# EAGLE design LoRa_E32_STM32F4 (EAGLE 9.6.2)
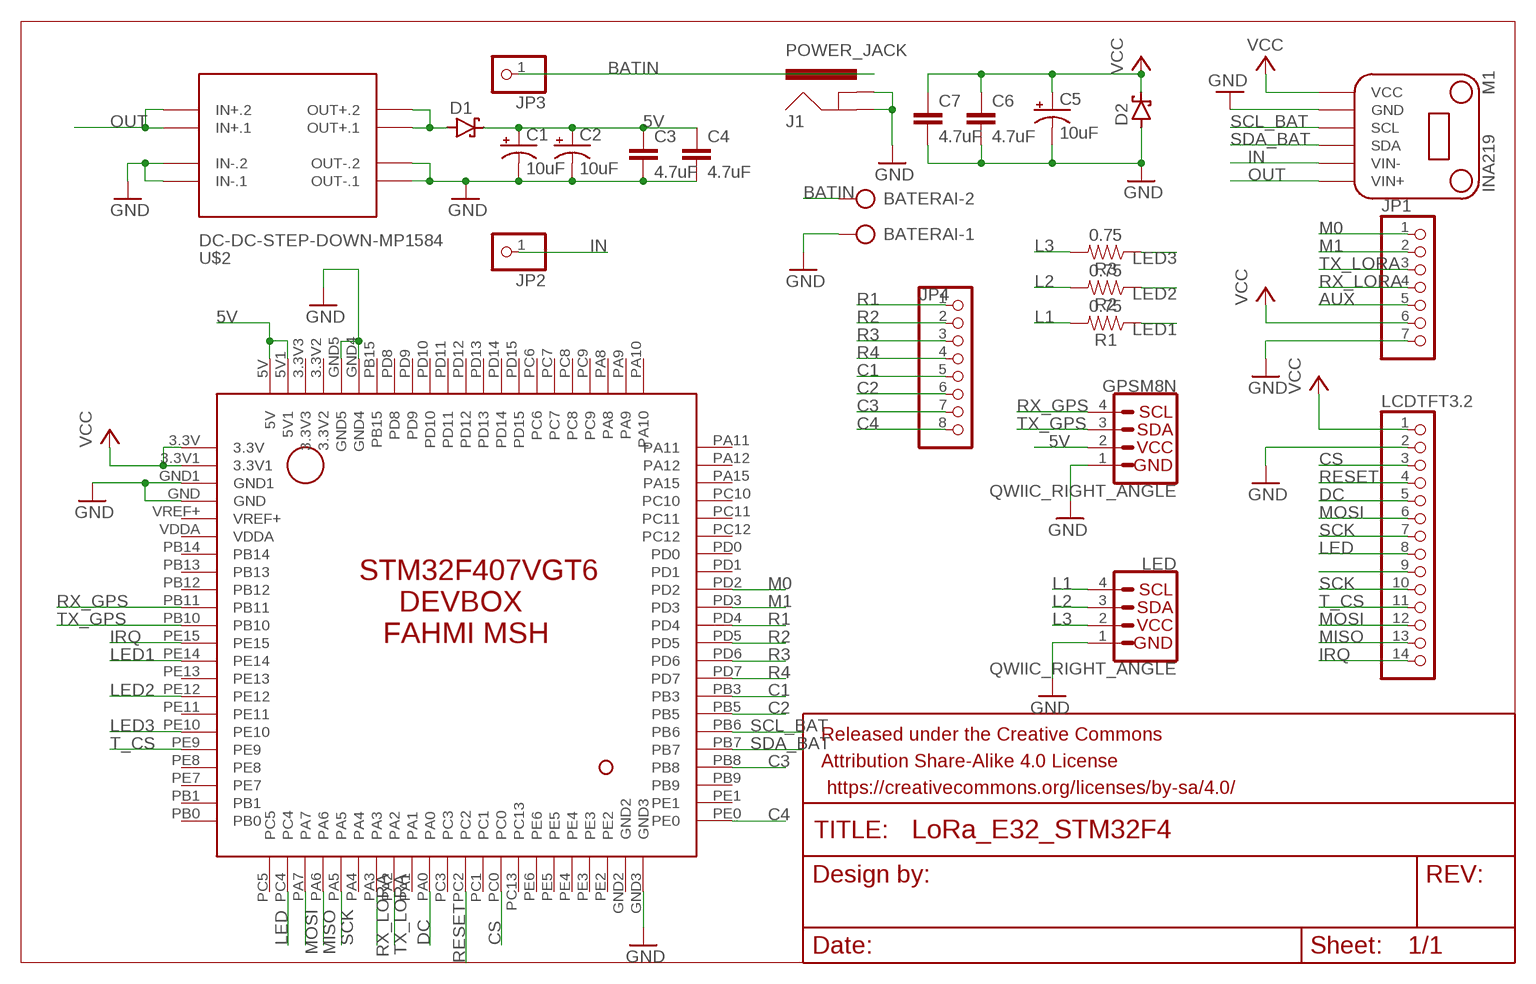
[diagram p0: schematic, sheet 1]

## Parts
BATERAI  AK500/2  [AK500/2]
C1  10uF  10UF-POLAR-EIA3216-16V-10%(TANT)  [EIA3216]
C2  10uF  10UF-POLAR-EIA3216-16V-10%(TANT)  [EIA3216]
C3  4.7uF  4.7UF-0805-50V-(10%)  [0805]
C4  4.7uF  4.7UF-0805-50V-(10%)  [0805]
C5  10uF  10UF-POLAR-EIA3216-16V-10%(TANT)  [EIA3216]
C6  4.7uF  4.7UF-0805-50V-(10%)  [0805]
C7  4.7uF  4.7UF-0805-50V-(10%)  [0805]
D1  SCHOTTKY-DIODESMD  [SMB]
D2  SCHOTTKY-DIODESMD  [SMB]
FRAME1  FRAME-LEDGER  [CREATIVE_COMMONS]
GPSM8N  QWIIC_RIGHT_ANGLE  QWIIC_CONNECTORJS-1MM  [JST04_1MM_RA]
J1  POWER_JACK  [POWER_JACK_PTH]
JP1  PINHD-1X7  [1X07]
JP2  PINHD-1X1  [1X01]
JP3  PINHD-1X1  [1X01]
JP4  PINHD-1X8/90  [1X08/90]
LCDTFT3.2  PINHD-1X14  [1X14]
LED  QWIIC_RIGHT_ANGLE  QWIIC_CONNECTORJS-1MM  [JST04_1MM_RA]
M1  INA219  [INA219]
R1  0.75  0.75OHM-0805-1/4W-1%  [0805]
R2  0.75  0.75OHM-0805-1/4W-1%  [0805]
R3  0.75  0.75OHM-0805-1/4W-1%  [0805]
U$1  STM32F4DEVBOX  [STM32F4DEVBOX]
U$2  DC-DC-STEP-DOWN-MP1584  [DC-DC-STEP-DOWN-MP1584]

## Nets
5V: C1.+ C2.+ C3.1 C4.1 D1.C GPSM8N.2 U$1.5V U$1.5V1
AUX: JP1.5
BATIN: BATERAI.2 J1.PWR JP3.1
C1: JP4.5 U$1.PB3
C2: JP4.6 U$1.PB5
C3: JP4.7 U$1.PB8
C4: JP4.8 U$1.PE0
CS: LCDTFT3.2.3 U$1.PC0
DC: LCDTFT3.2.5 U$1.PA0
GND: BATERAI.1 C1.- C2.- C3.2 C4.2 C5.- C6.2 C7.2 D2.A GPSM8N.1 J1.GND J1.GNDBREAK JP1.7 LCDTFT3.2.2 LED.1 M1.GND U$1.GND U$1.GND1 U$1.GND3 U$1.GND4 U$1.GND5 U$2.IN-.1 U$2.IN-.2 U$2.OUT-.1 U$2.OUT-.2
IN: JP2.1 M1.VIN-
IRQ: LCDTFT3.2.14 U$1.PE15
L1: LED.4 R1.2
L2: LED.3 R2.2
L3: LED.2 R3.2
LED: LCDTFT3.2.8 U$1.PC4
LED1: R1.1 U$1.PE14
LED2: R2.1 U$1.PE12
LED3: R3.1 U$1.PE10
M0: JP1.1 U$1.PD2
M1: JP1.2 U$1.PD3
MISO: LCDTFT3.2.13 U$1.PA6
MOSI: LCDTFT3.2.6 LCDTFT3.2.12 U$1.PA7
N$2: D1.A U$2.OUT+.1 U$2.OUT+.2
N$13: LCDTFT3.2.9
OUT: M1.VIN+ U$2.IN+.1 U$2.IN+.2
R1: JP4.1 U$1.PD4
R2: JP4.2 U$1.PD5
R3: JP4.3 U$1.PD6
R4: JP4.4 U$1.PD7
RESET: LCDTFT3.2.4 U$1.PC2
RX_GPS: GPSM8N.4 U$1.PB11
RX_LORA: JP1.4 U$1.PA3
SCK: LCDTFT3.2.7 LCDTFT3.2.10 U$1.PA5
SCL_BAT: M1.SCL U$1.PB6
SDA_BAT: M1.SDA U$1.PB7
T_CS: LCDTFT3.2.11 U$1.PE9
TX_GPS: GPSM8N.3 U$1.PB10
TX_LORA: JP1.3 U$1.PA2
VCC: C5.+ C6.1 C7.1 D2.C JP1.6 LCDTFT3.2.1 M1.VCC U$1.3.3V U$1.3.3V1
Unconnected: U$1.3.3V2 U$1.3.3V3 U$1.GND2 U$1.PA1 U$1.PA4 U$1.PA8 U$1.PA9 U$1.PA10 U$1.PA11 U$1.PA12 U$1.PA15 U$1.PB0 U$1.PB1 U$1.PB9 U$1.PB12 U$1.PB13 U$1.PB14 U$1.PB15 U$1.PC1 U$1.PC3 U$1.PC5 U$1.PC6 U$1.PC7 U$1.PC8 U$1.PC9 U$1.PC10 U$1.PC11 U$1.PC12 U$1.PC13 U$1.PD0 U$1.PD1 U$1.PD8 U$1.PD9 U$1.PD10 U$1.PD11 U$1.PD12 U$1.PD13 U$1.PD14 U$1.PD15 U$1.PE1 U$1.PE2 U$1.PE3 U$1.PE4 U$1.PE5 U$1.PE6 U$1.PE7 U$1.PE8 U$1.PE11 U$1.PE13 U$1.VDDA U$1.VREF+

## Library data of the parts
BATERAI = con-ptr500:AK500/2: CONNECTOR; OC_FARNELL: unknown; OC_NEWARK: unknown
C1 C2 C5 = SparkFun-Capacitors:10UF-POLAR: 10.0µF polarized capacitors A capacitor is a passive two-terminal electrical component used to store electrical energy temporarily in an electric field.; PROD_ID: CAP-00811
C3 C4 C6 C7 = SparkFun-Capacitors:4.7UF: 4.7µF ceramic capacitors A capacitor is a passive two-terminal electrical component used to store electrical energy temporarily in an electric field.; PROD_ID: CAP-15457
D1 D2 = diode:SCHOTTKY-DIODE: Schottky Diode
FRAME1 = SparkFun-Aesthetics:FRAME-LEDGER: Schematic Frame - Ledger Standard 11x14 US Ledger frame
GPSM8N LED = SparkFun-Connectors:QWIIC_CONNECTOR: SparkFun I2C Standard Qwiic Connector An SMD 1mm pitch JST connector makes it easy and quick (get it? Qwiic?) to connect I2C devices to each other. The Qwiic system <http://www.sparkfun.com/qwiic> enables fast and solderless connection between popular platforms and various sensors and actuators. We carry 200mm <https://www.sparkfun.com/products/14204>, 100mm <https://www.sparkfun.com/products/14205>, 50mm <https://www.sparkfun.com/products/14206>, and breadboard friendly <https://www.sparkfun.com/products/14207> Qwiic cables. We also offer 10 pcs strips <https://www.sparkfun.com/products/14323> the SMD connectors.; PROD_ID: CONN-13694
J1 = SparkFun-Connectors:POWER_JACK: Power Jack Connector This is the standard 5.5mm barrel jack for power. The PTH is the most common, proven, reliable, footprint. The Slot footprint only works if the mill layer is transmitted to the PCB fab house so be warned. Here are the connectors we sell at SparkFun: DC Barrel Power Jack/Connector <https://www.sparkfun.com/products/119> (PRT-00119) DC Barrel Power Jack/Connector (SMD) <https://www.sparkfun.com/products/12748> (PRT-12748) DC Barrel Jack Adapter - Breadboard Compatible <https://www.sparkfun.com/products/10811> (PRT-10811) It is used on this SparkFun product (and many, many others): SparkFun RedBoard - Programmed with Arduino <https://www.sparkfun.com/products/12757> (DEV-12757) Also, if you need a mating power supply or connector, please check these out: Wall Adapter Power Supply - 9VDC 650mA <https://www.sparkfun.com/products/298> (TOL-00298) DC Barrel Jack Adapter - Male <https://www.sparkfun.com/products/10287> (PRT-10287); PROD_ID: CONN-08197
JP1 = pinheadkecil:PINHD-1X7: PIN HEADER
JP2 JP3 = pinhead:PINHD-1X1: PIN HEADER
JP4 = pinhead:PINHD-1X8: PIN HEADER
LCDTFT3.2 = pinheadkecil:PINHD-1X14: PIN HEADER
M1 = INA219Module:INA219
R1-R3 = SparkFun-Resistors:0.75OHM: 0.75Ω resistor A resistor is a passive two-terminal electrical component that implements electrical resistance as a circuit element. Resistors act to reduce current flow, and, at the same time, act to lower voltage levels within circuits. - Wikipedia; PROD_ID: RES-08474
U$1 = STM32F4DEVBOX:STM32F4DEVBOX
U$2 = diy-modules:DC-DC-STEP-DOWN-MP1584: DC/DC Step-Down Regulator based on MP1584 chip MP1584 datasheet available here: http://www.haoyuelectronics.com/Attachment/MP1584/MP1584.pdf Click here to find device on ebay.com <http://www.ebay.com/sch/mp1584+module>

## Board
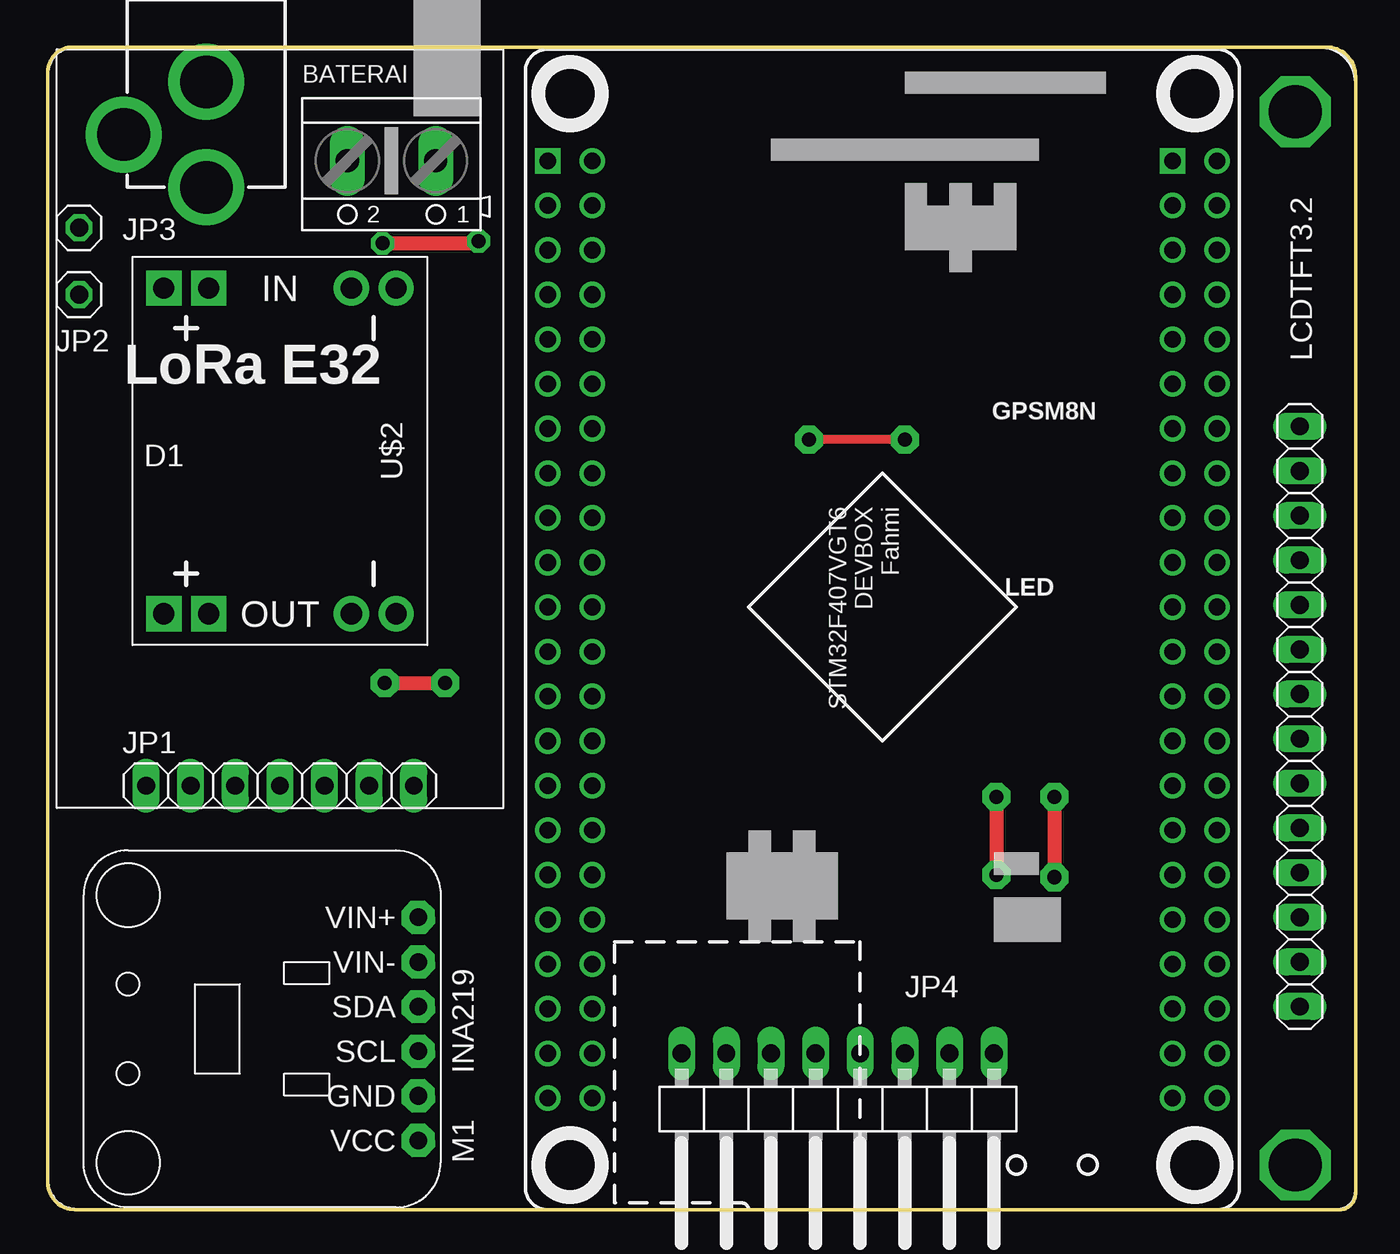
[diagram p1: board, top side]
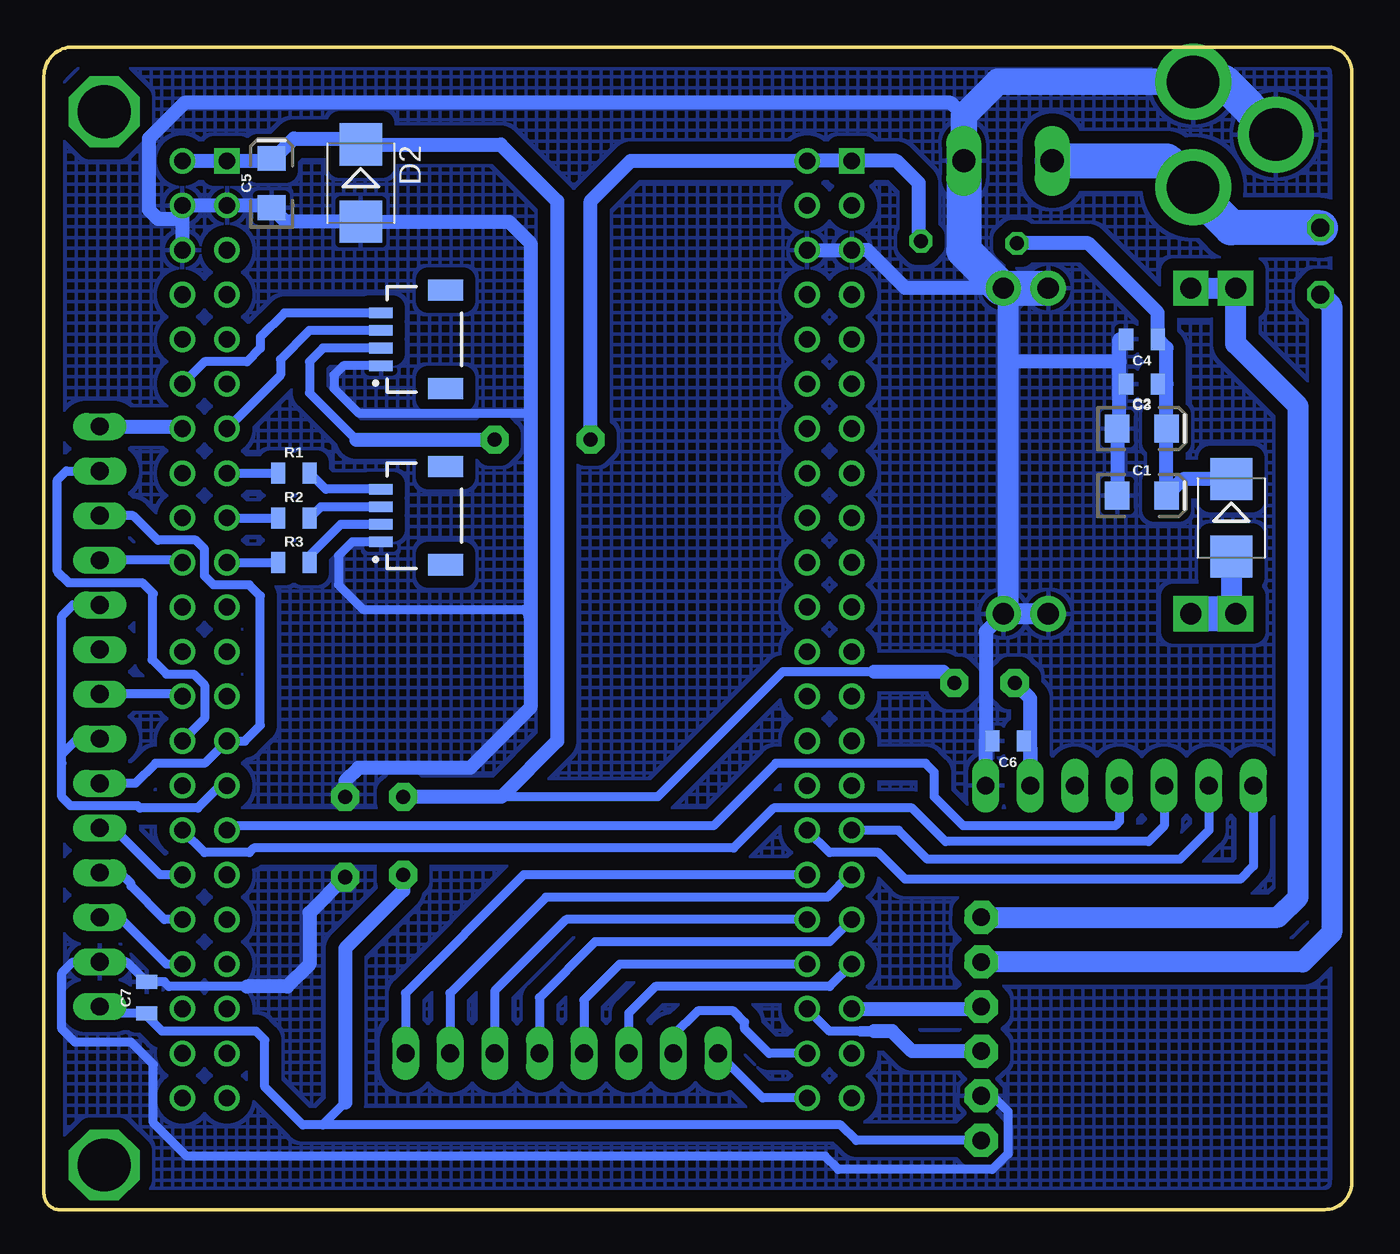
[diagram p2: board, bottom side, seen from below]

Size 74.42 x 66.17 mm. Coordinates in mm from the lower left corner, seen from the top.
Outline: 1.52,0 73.53,0 arc90 74.42,0.89 74.42,64.52 arc90 72.77,66.17 1.4,66.17 arc90 0,64.77 0,1.52 arc90 1.52,0
Copper layers (1*16): Top 0.035mm / dielectric 1.5mm / Bottom 0.035mm
Design rules "default": minimum track width 6mil, minimum drill 0.35mm, track to track 6mil, track to pad 6mil, pad to pad 6mil, via to via 6mil, smd to smd 6mil, copper to edge 40mil, drill to drill 6mil, minimum pad ring 10mil, minimum via ring 8mil, stop-mask expansion 4mil, vias tented up to drill 0mil, thermal gap 10mil

### Footprints (pad centres in the part's own frame; a part is rotated, then mirrored left to right if it is on the bottom)
AK500/2 = drill 1.321 long: 1 -2.515,0; 2 2.515,0
EIA3216 = smd 1.4 x 1.6: + 1.4,0; - -1.4,0
0805 = smd 0.8 x 1.2: 1 -0.9,0; 2 0.9,0
SMB = smd 2.4 x 2.4: A 2.2,0; C -2.2,0
JST04_1MM_RA = smd 0.6 x 1.35: 1 -1.5,0; 2 -0.5,0; 3 0.5,0; 4 1.5,0 | smd 1.2 x 2: NC1 2.8,-3.675; NC2 -2.8,-3.675
POWER_JACK_PTH = drill 2.997 pad 4.318: GND 0,7.7; GNDBREAK 4.7,10.7; PWR 0,13.7
1X07 = drill 1.016 long: 1 -7.62,0; 2 -5.08,0; 3 -2.54,0; 4 0,0; 5 2.54,0; 6 5.08,0; 7 7.62,0
1X01 = drill 1.016 octagon: 1 0,0
1X08/90 = drill 1.016 long: 1 -8.89,-3.81; 2 -6.35,-3.81; 3 -3.81,-3.81; 4 -1.27,-3.81; 5 1.27,-3.81; 6 3.81,-3.81; 7 6.35,-3.81; 8 8.89,-3.81
1X14 = drill 1.016 long: 1 -16.51,0; 2 -13.97,0; 3 -11.43,0; 4 -8.89,0; 5 -6.35,0; 6 -3.81,0; 7 -1.27,0; 8 1.27,0; 9 3.81,0; 10 6.35,0; 11 8.89,0; 12 11.43,0; 13 13.97,0; 14 16.51,0
INA219 = drill 1 pad 1.9 octagon: GND 6.35,1.27; SCL 8.89,1.27; SDA 11.43,1.27; VCC 3.81,1.27; VIN+ 16.51,1.27; VIN- 13.97,1.27
STM32F4DEVBOX = drill 0.95 square: 3.3V 35.56,71.12; 5V1 0,71.12 | drill 0.95: 3.3V1 38.1,71.12; 3.3V2 2.54,68.58; 3.3V3 0,68.58; 5V 2.54,71.12; GND 35.56,68.58; GND1 38.1,68.58; GND2 35.56,66.04; GND3 38.1,66.04; GND4 2.54,66.04; GND5 0,66.04; PA0 38.1,30.48; PA1 35.56,30.48; PA2 38.1,33.02; PA3 35.56,33.02; PA4 38.1,35.56; PA5 35.56,35.56; PA6 38.1,38.1; PA7 35.56,38.1; PA8 0,48.26; PA9 2.54,45.72; PA10 0,45.72; PA11 2.54,43.18; PA12 0,43.18; PA15 2.54,40.64; PB0 38.1,43.18; PB1 35.56,43.18; PB3 2.54,25.4; PB5 0,25.4; PB6 2.54,22.86; PB7 0,22.86; PB8 2.54,20.32; PB9 0,20.32; PB10 35.56,55.88; PB11 38.1,58.42; PB12 35.56,58.42; PB13 38.1,60.96; PB14 35.56,60.96; PB15 2.54,63.5; PC0 38.1,25.4; PC1 35.56,25.4; PC2 38.1,27.94; PC3 35.56,27.94; PC4 38.1,40.64; PC5 35.56,40.64; PC6 0,53.34; PC7 2.54,50.8; PC8 0,50.8; PC9 2.54,48.26; PC10 0,40.64; PC11 2.54,38.1; PC12 0,38.1; PC13 35.56,22.86; PD0 2.54,35.56; PD1 0,35.56; PD2 2.54,33.02; PD3 0,33.02; PD4 2.54,30.48; PD5 0,30.48; PD6 2.54,27.94; PD7 0,27.94; PD8 0,63.5; PD9 2.54,60.96; PD10 0,60.96; PD11 2.54,58.42; PD12 0,58.42; PD13 2.54,55.88; PD14 0,55.88; PD15 2.54,53.34; PE0 2.54,17.78; PE1 0,17.78; PE2 38.1,17.78; PE3 35.56,17.78; PE4 38.1,20.32; PE5 35.56,20.32; PE6 38.1,22.86; PE7 38.1,45.72; PE8 35.56,45.72; PE9 38.1,48.26; PE10 35.56,48.26; PE11 38.1,50.8; PE12 35.56,50.8; PE13 38.1,53.34; PE14 35.56,53.34; PE15 38.1,55.88; VDDA 35.56,63.5; VREF+ 38.1,63.5
DC-DC-STEP-DOWN-MP1584 = drill 1.2 pad 2 square: IN+.1 -9.271,-4.064; IN+.2 -9.271,-6.604; OUT+.1 9.271,-4.064; OUT+.2 9.271,-6.604 | drill 1.2 pad 2: IN-.1 -9.271,6.604; IN-.2 -9.271,4.064; OUT-.1 9.271,6.604; OUT-.2 9.271,4.064

### Placement (x,y rotation side)
BATERAI  19.56,59.69 180 top
C1  11.94,40.64 0 bottom
C2  11.94,44.45 0 bottom
C3  11.94,46.99 180 bottom
C4  11.94,49.53 180 bottom
C5  61.47,58.42 90 bottom
C6  19.56,26.67 180 bottom
C7  68.58,12.06 90 bottom
D1  6.86,39.37 270 bottom
D2  56.39,58.42 270 bottom
FRAME1  62.74,-11.43 0 bottom  (outside the outline)
GPSM8N  55.25,49.53 90 bottom
J1  9.02,71.88 180 top
JP1  13.21,24.13 0 top
JP2  1.78,52.07 0 top
JP3  1.78,55.88 0 top
JP4  44.96,5.08 180 top
LCDTFT3.2  71.25,28.07 90 top
LED  55.25,39.5 90 bottom
M1  22.35,0.13 90 top
R1  60.2,41.91 0 bottom
R2  60.2,39.37 0 bottom
R3  60.2,36.83 0 bottom
U$1  28.45,-11.43 0 top
U$2  13.21,43.18 270 top

### Tracks (layer width: path | path; a pad name or v marks a point on that pad's centre or on a via)
5V  (via drill 0.8 pad 1.3, 0.8 pad 1.6)
  Top 0.5: v48.77,43.81 v43.31,43.81
  Top 0.8: v19.05,54.99 24.38,54.99 v24.51,55.12
  Bottom 0.5: GPSM8N.2 58.54,49.03 59.31,48.26 59.31,46.48 56.64,43.81
  Bottom 0.8: D1.C 9.61,41.57 C1.+ C2.+ 10.54,46.99 | 10.54,46.99 10.54,49.03 C4.1 11.04,51.04 14.99,54.99 v19.05,54.99 | C3.1 10.54,46.99 | v24.51,55.12 24.64,55.25 24.64,58.42 25.91,59.69 U$1.5V1 U$1.5V 41.02,59.69 43.31,57.4 v43.31,43.81 | 56.64,43.81 v48.77,43.81
BATIN
  Bottom 2: BATERAI.2 10.52,59.69 J1.PWR 9.02,58.04 6.86,55.88 JP3.1
C1
  Bottom 0.5: U$1.PB3 41.66,13.97 43.69,11.94 JP4.5
C2
  Bottom 0.5: U$1.PB5 29.72,12.7 39.62,12.7 41.15,11.18 JP4.6
C3
  Bottom 0.5: U$1.PB8 33.15,8.89 34.54,10.29 34.54,10.67 35.18,11.3 37.21,11.3 38.61,9.91 JP4.7
C4
  Bottom 0.5: U$1.PE0 33.53,6.35 JP4.8
CS
  Bottom 0.5: U$1.PC0 67.44,13.97 70.1,16.64 LCDTFT3.2.3
DC
  Bottom 0.5: U$1.PA0 67.82,19.05 70.48,21.72 LCDTFT3.2.5
GND  (via drill 0.8 pad 1.6)
  Top 0.8: v57.28,23.5 v57.28,18.92
  Bottom 0.5: M1.GND 20.45,6.48 19.56,5.59 19.56,3.18 20.45,2.29 29.21,2.29 29.97,3.05 66.29,3.05 68.2,4.95 68.2,8.25 69.47,9.52 72.64,9.52 73.41,10.29 73.41,13.46 72.77,14.1 LCDTFT3.2.2 69.71,14.1 C7.2 67.58,12.96 67.31,12.7 62.86,12.7 | LED.1 56.87,38 57.66,37.21 57.66,35.56 56.26,34.16 47.12,34.16 46.74,33.78 | GPSM8N.1 57.38,48.03 57.91,47.5 57.91,46.74 56.52,45.34 46.74,45.34
  Bottom 0.8: 13.21,46.99 13.21,44.58 C2.- C1.- | 13.21,46.99 13.21,48.26 | 13.21,48.26 13.21,49.53 C4.2 | C3.2 13.21,46.99 | 13.21,48.26 19.56,48.26 | JP1.7 20.83,26.67 | 20.83,26.67 C6.2 | 66.55,56.39 U$1.GND1 U$1.GND 61.6,57.15 C5.- 60.67,56.22 D2.A 47.97,56.22 46.74,54.99 46.74,45.34 46.74,33.78 46.74,28.57 50.16,25.15 56.52,25.15 57.28,24.38 v57.28,23.5 | 66.55,56.39 U$1.GND3 | U$1.GND4 U$1.GND5 27.56,54.61 25.4,52.45 U$2.IN-.1 | 22.07,62.26 22.81,62.99 66.42,62.99 68.45,60.96 68.45,56.9 67.94,56.39 66.55,56.39 | v57.28,18.92 59.31,16.89 59.31,13.97 60.58,12.7 62.86,12.7 | U$2.OUT-.1 20.83,32.89 20.83,26.67
  Bottom 1.2: U$2.OUT-.2 19.56,33.91 | 19.56,33.91 U$2.OUT-.1 | U$2.IN-.1 19.56,52.2 19.56,48.26 19.56,33.91
  Bottom 1.5: J1.GND 20.15,64.18 22.07,62.26 BATERAI.1
  Bottom 2: J1.GNDBREAK 7.32,64.18 J1.GND | BATERAI.1 22.07,54.59 19.94,52.45 U$2.IN-.1 U$2.IN-.2
  pour Bottom (isolate 0.7, hatched): 71.63,0 1.78,0 arc-90 0,1.78 0,4.57 0,64.64 arc-90 1.52,66.17 10.92,66.17 69.09,66.17 arc-90 74.42,60.83 74.42,44.7 74.42,2.16 74.42,1.14 arc-90 73.28,0
IN
  Bottom 1.2: JP2.1 1.14,51.44 1.14,15.75 2.79,14.1 M1.VIN-
IRQ
  Bottom 0.8: LCDTFT3.2.14 66.67,44.58 U$1.PE15
L1
  Bottom 0.5: LED.4 58.39,41 R1.2
L2
  Bottom 0.5: LED.3 58.67,40 R2.2
L3
  Bottom 0.5: LED.2 57.52,39 59.3,37.22 R3.2
LED
  Bottom 0.5: U$1.PC4 66.67,29.34 LCDTFT3.2.8
LED1
  Bottom 0.5: U$1.PE14 R1.1
LED2
  Bottom 0.5: U$1.PE12 R2.1
LED3
  Bottom 0.5: U$1.PE10 R3.1
M0
  Bottom 0.5: JP1.1 5.59,19.56 6.35,18.8 25.4,18.8 26.92,20.32 29.72,20.32 U$1.PD2
M1
  Bottom 0.5: JP1.2 8.13,21.59 9.78,19.94 24.13,19.94 25.78,21.59 U$1.PD3
MISO
  Bottom 0.5: LCDTFT3.2.13 73.15,42.04 73.66,41.53 73.66,36.32 73.03,35.69 68.83,35.69 68.26,35.12 | 68.26,35.12 68.2,35.05 | 68.26,35.12 68.26,31.3 67.44,30.48 65.91,30.48 65.28,29.85 65.28,27.94 U$1.PA6
MOSI
  Bottom 0.5: LCDTFT3.2.6 69.22,24.26 68.07,25.4 65.28,25.4 U$1.PA7 62.99,26.67 62.1,27.56 62.1,34.92 62.74,35.56 64.77,35.56 65.28,36.07 65.28,37.59 65.79,38.1 67.94,38.1 69.34,39.5 LCDTFT3.2.12
N$1  (via drill 3 pad 1.6)
  other vias: 70.99,62.48
N$2
  Bottom 1.2: D1.A 6.86,34.16 U$2.OUT+.2
  Bottom 2: U$2.OUT+.2 U$2.OUT+.1
N$3  (via drill 3 pad 1.6)
  other vias: 70.99,2.54
OUT
  Bottom 1.2: M1.VIN+ 4.19,16.64 3.05,17.78 3.05,45.72 6.6,49.28 U$2.IN+.2 U$2.IN+.1
R1
  Bottom 0.5: U$1.PD4 47.12,19.05 53.85,12.32 JP4.1
R2
  Bottom 0.5: U$1.PD5 28.58,19.05 29.84,17.78 45.85,17.78 51.31,12.32 JP4.2
R3
  Bottom 0.5: U$1.PD6 44.7,16.51 48.77,12.45 JP4.3
R4
  Bottom 0.5: U$1.PD7 29.72,15.24 43.05,15.24 46.23,12.06 JP4.4
RESET
  Bottom 0.5: U$1.PC2 67.56,16.51 69.47,18.42 69.47,18.54 70.1,19.18 LCDTFT3.2.4
RX_GPS
  Bottom 0.5: GPSM8N.4 60.73,51.03 62.1,49.66 62.1,49.02 62.86,48.26 65.28,48.26 U$1.PB11
RX_LORA
  Bottom 0.5: JP1.4 13.21,22.1 13.46,21.84 22.1,21.84 23.75,23.5 23.75,24.89 24.26,25.4 32.77,25.4 36.32,21.84 63.75,21.84 U$1.PA3
SCK
  Bottom 0.5: U$1.PA5 64.39,24.13 65.66,22.86 68.96,22.86 69.09,22.99 72.9,22.99 73.41,23.5 73.41,25.4 73.41,25.91 | 73.41,25.91 72.52,26.8 LCDTFT3.2.7 | 73.41,25.91 73.41,33.78 72.77,34.42 LCDTFT3.2.10
SCL_BAT
  Bottom 0.5: 27.94,10.16 29.72,10.16 U$1.PB6
  Bottom 0.6: 27.18,10.16 27.94,10.16
  Bottom 0.8: 27.18,10.16 26.16,10.16 25.02,9.02 M1.SCL
SDA_BAT
  Bottom 0.8: M1.SDA 21.21,11.43 U$1.PB7
T_CS
  Bottom 0.5: U$1.PE9 66.67,36.96 LCDTFT3.2.11
TX_GPS
  Bottom 0.5: GPSM8N.3 59.32,50.03 60.96,48.39 60.96,47.5 U$1.PB10
TX_LORA
  Bottom 0.5: JP1.3 10.67,21.84 11.56,20.96 23.11,20.96 25.02,22.86 32.89,22.86 35.18,20.57 62.48,20.57 62.74,20.32 65.28,20.32 U$1.PA2
VCC  (via drill 0.8 pad 1.6)
  Top 0.8: v19.18,29.97 v22.61,29.97 | v53.97,23.5 v53.97,19.05
  Bottom 0.5: C7.1 68.71,11.16 | 68.71,11.16 70.86,11.16 LCDTFT3.2.1 | M1.VCC 28.19,3.94 29.08,4.83 58.55,4.83 | 68.71,11.16 67.7,10.16 62.36,10.16 61.85,9.65 61.85,6.98 59.69,4.83 58.55,4.83 | 57.28,6.1 58.55,4.83 | 27.18,30.61 32.39,30.61 39.5,23.5 48.39,23.5
  Bottom 0.8: C6.1 18.29,26.3 JP1.6 18.29,29.08 v19.18,29.97 | U$1.3.3V1 U$1.3.3V 61.6,59.69 C5.+ 61.34,59.82 60.2,60.96 56.73,60.96 D2.C 48.43,60.62 45.21,57.4 45.21,26.67 48.39,23.5 v53.97,23.5 | v22.61,29.97 23.24,30.61 27.18,30.61 | v53.97,19.05 53.97,18.16 57.28,14.86 57.28,6.1